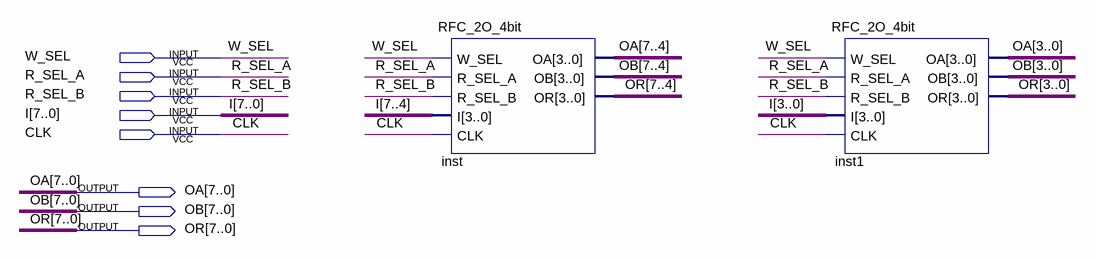
[diagram p0: schematic sheet]
// Quartus schematic RFC_2O_8bit.bdf as structural Verilog: 2 symbols, 8 pins
module RFC_2O_8bit (
  input  W_SEL,
  input  R_SEL_A,
  input  R_SEL_B,
  input  [7:0] I,
  input  CLK,
  output [7:0] OA,
  output [7:0] OB,
  output [7:0] OR
);

  RFC_2O_4bit inst (
    .W_SEL(W_SEL), .R_SEL_A(R_SEL_A), .R_SEL_B(R_SEL_B), .I(I[7:4]), .CLK(CLK), .OA(OA[7:4]), .OB(OB[7:4]),
    .OR(OR[7:4]));
  RFC_2O_4bit inst1 (
    .W_SEL(W_SEL), .R_SEL_A(R_SEL_A), .R_SEL_B(R_SEL_B), .I(I[3:0]), .CLK(CLK), .OA(OA[3:0]), .OB(OB[3:0]),
    .OR(OR[3:0]));
endmodule
